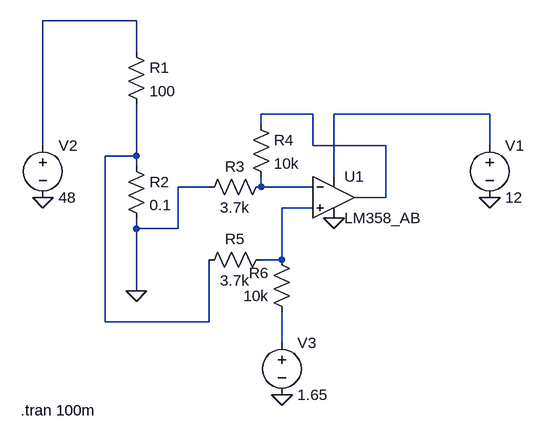
[diagram p0: schematic Current Sensor.asc]
Current Sensor.asc, the LTspice schematic file:
Version 4
SHEET 1 880 680
WIRE -48 -96 -192 -96
WIRE -48 -48 -48 -96
WIRE 224 48 144 48
WIRE 496 48 256 48
WIRE 144 64 144 48
WIRE -192 96 -192 -96
WIRE 224 96 224 48
WIRE 336 96 224 96
WIRE 496 96 496 48
WIRE -48 112 -48 32
WIRE -48 112 -96 112
WIRE -48 128 -48 112
WIRE 256 144 256 48
WIRE 64 160 16 160
WIRE 144 160 144 144
WIRE 224 160 144 160
WIRE 336 176 336 96
WIRE 336 176 288 176
WIRE 224 192 176 192
WIRE -96 368 -96 112
WIRE -48 224 -48 208
WIRE 16 224 16 160
WIRE 16 224 -48 224
WIRE 176 272 176 192
WIRE 176 272 144 272
WIRE -48 320 -48 224
WIRE 64 368 64 272
WIRE 64 368 -96 368
WIRE 176 400 176 352
FLAG 496 176 0
FLAG 256 208 0
FLAG -48 320 0
FLAG -192 176 0
FLAG 176 480 0
SYMBOL ZZZ\\OpAmp\\LM358_AB 256 112 R0
SYMATTR InstName U1
SYMBOL voltage 496 80 R0
WINDOW 123 0 0 Left 0
WINDOW 39 0 0 Left 0
SYMATTR InstName V1
SYMATTR Value 12
SYMBOL voltage -192 80 R0
WINDOW 123 0 0 Left 0
WINDOW 39 0 0 Left 0
SYMATTR InstName V2
SYMATTR Value 48
SYMBOL res -64 -64 R0
SYMATTR InstName R1
SYMATTR Value 100
SYMBOL res -64 112 R0
SYMATTR InstName R2
SYMATTR Value 0.1
SYMBOL res 160 144 R90
WINDOW 0 0 56 VBottom 2
WINDOW 3 32 56 VTop 2
SYMATTR InstName R3
SYMATTR Value 3.7k
SYMBOL res 128 48 R0
SYMATTR InstName R4
SYMATTR Value 10k
SYMBOL res 160 256 R90
WINDOW 0 0 56 VBottom 2
WINDOW 3 32 56 VTop 2
SYMATTR InstName R5
SYMATTR Value 3.7k
SYMBOL res 192 368 R180
WINDOW 0 36 76 Left 2
WINDOW 3 36 40 Left 2
SYMATTR InstName R6
SYMATTR Value 10k
SYMBOL voltage 176 384 R0
WINDOW 123 0 0 Left 0
WINDOW 39 0 0 Left 0
SYMATTR InstName V3
SYMATTR Value 1.65
TEXT -226 504 Left 2 !.tran 100m

The netlist it stands for:
* Current Sensor.asc
* U1: LM358_AB (symbol ZZZ\OpAmp\LM358_AB not available, pins judged from their places): In+=N006 In-=N005 V+=N003 V-=0 OUT=N002
V1 N003 0 12
V2 N001 0 48
R1 N001 N004 100
R2 N004 0 0.1
R3 N005 0 3.7k
R4 N002 N005 10k
R5 N006 N004 3.7k
R6 N007 N006 10k
V3 N007 0 1.65
.tran 100m
.backanno
.end